# Altium schematic sheet PowerSupply.SchDoc
size Letter; SheetNumber: 3; SheetTotal: 5
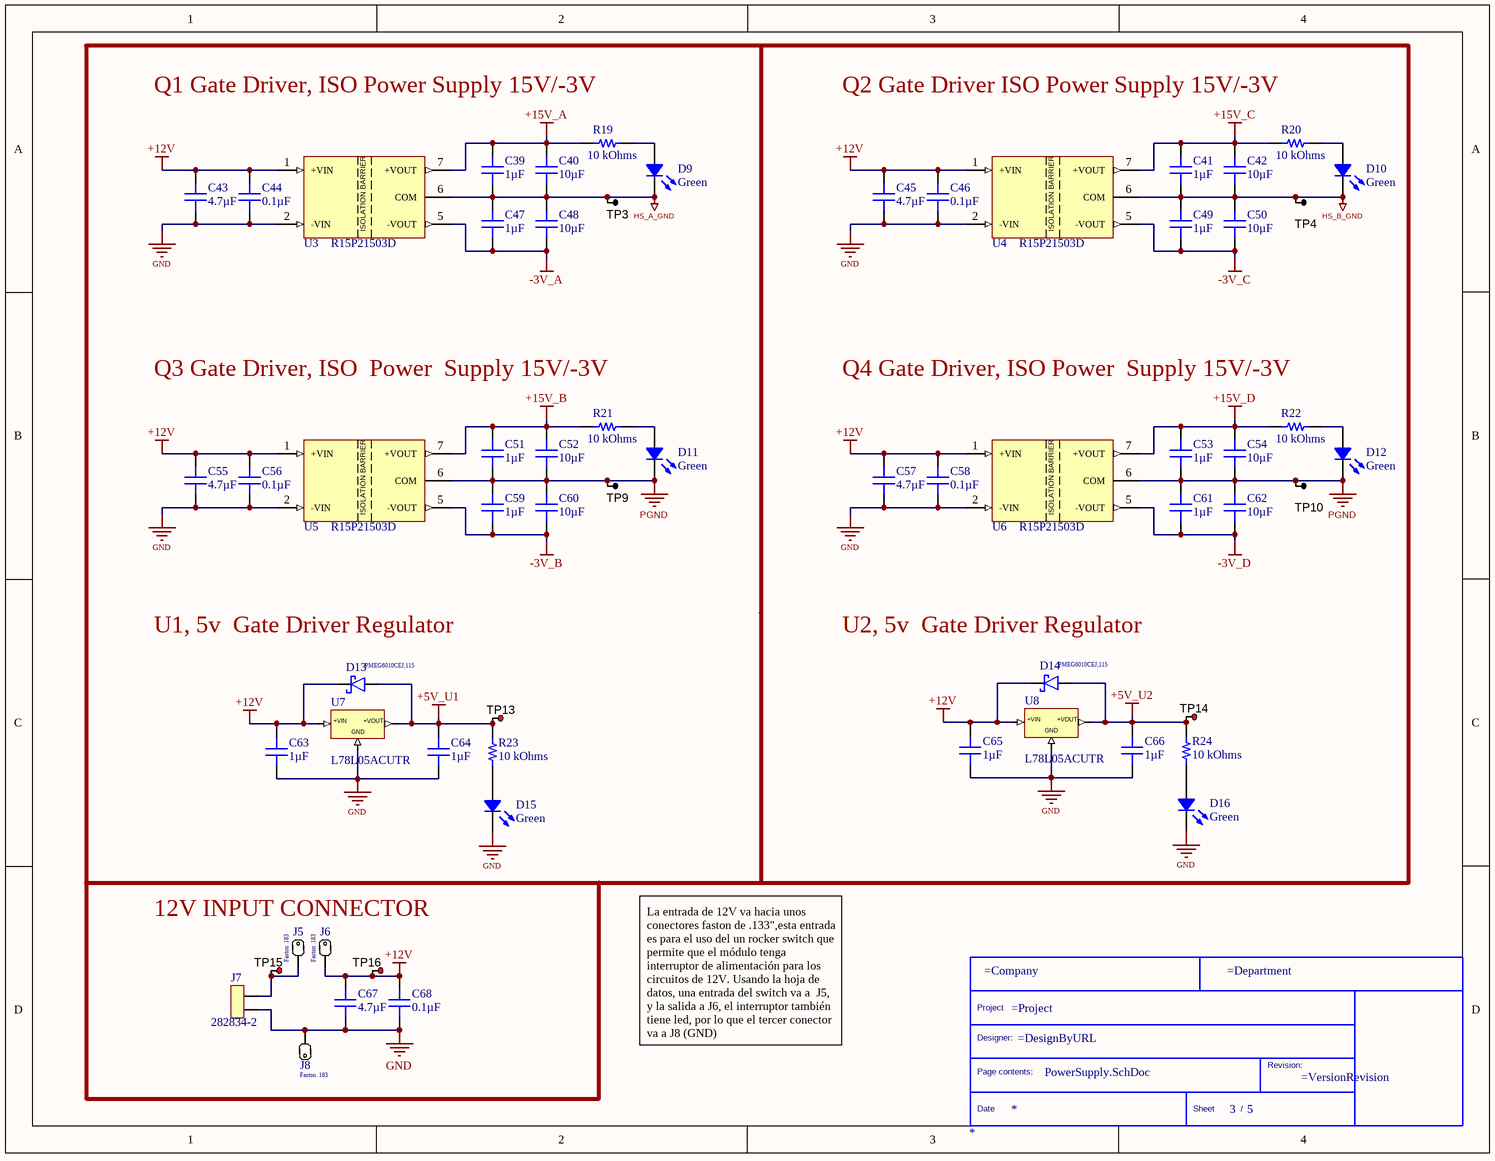
[diagram p0: PowerSupply.SchDoc]

## Parts
*  TittleBlock  (value not drawn)  (graphical)
C39  1µF  [CAP 0603_1608]
C40  10µF  [CAP 1206_3216 - 1.8MM]
C41  1µF  [CAP 0603_1608]
C42  10µF  [CAP 1206_3216 - 1.8MM]
C43  4.7µF  [CAP 1206_3216 - 1.8MM]
C44  0.1µF  [CAP 0603_1608]
C45  4.7µF  [CAP 1206_3216 - 1.8MM]
C46  0.1µF  [CAP 0603_1608]
C47  1µF  [CAP 0603_1608]
C48  10µF  [CAP 1206_3216 - 1.8MM]
C49  1µF  [CAP 0603_1608]
C50  10µF  [CAP 1206_3216 - 1.8MM]
C51  1µF  [CAP 0603_1608]
C52  10µF  [CAP 1206_3216 - 1.8MM]
C53  1µF  [CAP 0603_1608]
C54  10µF  [CAP 1206_3216 - 1.8MM]
C55  4.7µF  [CAP 1206_3216 - 1.8MM]
C56  0.1µF  [CAP 0603_1608]
C57  4.7µF  [CAP 1206_3216 - 1.8MM]
C58  0.1µF  [CAP 0603_1608]
C59  1µF  [CAP 0603_1608]
C60  10µF  [CAP 1206_3216 - 1.8MM]
C61  1µF  [CAP 0603_1608]
C62  10µF  [CAP 1206_3216 - 1.8MM]
C63  1µF  [CAP 0603_1608]
C64  1µF  [CAP 0603_1608]
C65  1µF  [CAP 0603_1608]
C66  1µF  [CAP 0603_1608]
C67  4.7µF  [CAP 1206_3216 - 1.8MM]
C68  0.1µF  [CAP 0603_1608]
D9  Green  [LED 0603_1608 GREEN]
D10  Green  [LED 0603_1608 GREEN]
D11  Green  [LED 0603_1608 GREEN]
D12  Green  [LED 0603_1608 GREEN]
D13  PMEG6010CEJ,115  [SOD-323F]
D14  PMEG6010CEJ,115  [SOD-323F]
D15  Green  [LED 0603_1608 GREEN]
D16  Green  [LED 0603_1608 GREEN]
J5  Faston .183  [TE_1217133-1]
J6  Faston .183  [TE_1217133-1]
J7  282834-2  [TE 282834-2]
J8  Faston .183  [TE_1217133-1]
R19  10 kOhms  [RES 0603_1608]
R20  10 kOhms  [RES 0603_1608]
R21  10 kOhms  [RES 0603_1608]
R22  10 kOhms  [RES 0603_1608]
R23  10 kOhms  [RES 0603_1608]
R24  10 kOhms  [RES 0603_1608]
TP3  5011  [Keystone5011]  (value not drawn)
TP4  5011  [Keystone5011]  (value not drawn)
TP9  5011  [Keystone5011]  (value not drawn)
TP10  5011  [Keystone5011]  (value not drawn)
TP13  5010  [Keystone5010]  (value not drawn)
TP14  5010  [Keystone5010]  (value not drawn)
TP15  5010  [Keystone5010]  (value not drawn)
TP16  5010  [Keystone5010]  (value not drawn)
U3  R15P21503D  [CONV_R15P21503D]
U4  R15P21503D  [CONV_R15P21503D]
U5  R15P21503D  [CONV_R15P21503D]
U6  R15P21503D  [CONV_R15P21503D]
U7  L78L05ACUTR  [VREG_L78L12ABUTR]
U8  L78L05ACUTR  [VREG_L78L12ABUTR]

## Nets
+5V_U1: C64.2 D13.2 R23.1 TP13.1 U7.1(OUT)
+5V_U2: C66.2 D14.2 R24.1 TP14.1 U8.1(OUT)
+12V: C43.2 C44.2 C45.2 C46.2 C55.2 C56.2 C57.2 C58.2 C63.2 C65.2 C67.2 C68.2 D13.1 D14.1 J6.1(P1) TP16.1 U3.1(+VIN) U4.1(+VIN) U5.1(+VIN) U6.1(+VIN) U7.3(IN) U8.3(IN)
+15V_A: C39.2 C40.2 R19.1 U3.7(+VOUT)
+15V_B: C51.2 C52.2 R21.1 U5.7(+VOUT)
+15V_C: C41.2 C42.2 R20.1 U4.7(+VOUT)
+15V_D: C53.2 C54.2 R22.1 U6.7(+VOUT)
-3V_A: C47.1 C48.1 U3.5(-VOUT)
-3V_B: C59.1 C60.1 U5.5(-VOUT)
-3V_C: C49.1 C50.1 U4.5(-VOUT)
-3V_D: C61.1 C62.1 U6.5(-VOUT)
GND: C43.1 C44.1 C45.1 C46.1 C55.1 C56.1 C57.1 C58.1 C63.1 C64.1 C65.1 C66.1 C67.1 C68.1 D15.2 D16.2 J7.2 J8.1(P1) U3.2(-VIN) U4.2(-VIN) U5.2(-VIN) U6.2(-VIN) U7.2(GND) U8.2(GND)
HS_A_GND: C39.1 C40.1 C47.2 C48.2 D9.2 TP3.1 U3.6(COM)
HS_B_GND: C41.1 C42.1 C49.2 C50.2 D10.2 TP4.1 U4.6(COM)
PGND: C51.1 C52.1 C53.1 C54.1 C59.2 C60.2 C61.2 C62.2 D11.2 D12.2 TP9.1 TP10.1 U5.6(COM) U6.6(COM)
NetD9_1: D9.1 R19.2
NetD10_1: D10.1 R20.2
NetD11_1: D11.1 R21.2
NetD12_1: D12.1 R22.2
NetD15_1: D15.1 R23.2
NetD16_1: D16.1 R24.2
NetJ5_1: J5.1(P1) J7.1 TP15.1

## Notes on the sheet
- Q1 Gate Driver, ISO Power Supply 15V/-3V
- Q2 Gate Driver ISO Power Supply 15V/-3V
- Q3 Gate Driver, ISO  Power  Supply 15V/-3V
- Q4 Gate Driver, ISO Power  Supply 15V/-3V
- (near D13) U1, 5v  Gate Driver Regulator
- (near D14) U2, 5v  Gate Driver Regulator
- 12V INPUT CONNECTOR
- La entrada de 12V va hacia unos conectores faston de .133",esta entrada es para el uso del un rocker switch que permite que el módulo tenga interruptor de alimentación para los circuitos de 12V. Usando la hoja de datos, una entrada del switch va a  J5, y la salida a J6, el interruptor también tiene led, por lo que el tercer conector  va a J8 (GND)
  .
- (in symbol L78L05ACUTR) +VIN; +VOUT
- (in symbol R15P21503D) ISOLATION BARRIER
- (in symbol TittleBlock) Project; Designer:; Page contents:; Revision:; Date; Sheet; /

## Library data of the parts
* = TittleBlock: Standard Title block
C39 C41 C47 C49 C51 C53 C59 C61 = UMK107AB7105KA-T: CAP CER 1UF 50V X7R 0603; Manufacturer: Taiyo Yuden; Tolerance: ±10%; Part Number: UMK107AB7105KA-T; Value: 1µF; Applications: General Purpose; Capacitance: 1µF; ComponentLink1Description: Datasheet; ComponentLink1URL: https://www.yuden.co.jp/productdata/catalog/mlcc01_e.pdf; ComponentLink2Description: DigiKey Link; ComponentLink2URL: http://digikey.com/product-detail/en/taiyo-yuden/UMK107AB7105KA-T/587-3247-1-ND/3660107; Device Package: 0603 (1608 Metric); LastUpdated: 2/9/2020 01:03:17; Lifecycle Status: Active; Minimum Order: 1; Mounting Type: Surface Mount, MLCC; Operating Temperature: -55°C ~ 125°C; Package / Case: 0603 (1608 Metric); Packaging: TapeAndReel; PartId: 12796; Part Status: Active; Price: 0.05; Series: M; Size / Dimension: 0.063" L x 0.031" W (1.60mm x 0.80mm); Supplier 1: DigiKey; Supplier Part Number 1: 587-3247-1-ND; Temperature Coefficient: X7R; Thickness (Max): 0.037" (0.95mm); Voltage - Rated: 50V
C40 C42 C48 C50 C52 C54 C60 C62 = TMK316AB7106KL-T: CAP CER 10UF 25V X7R 1206; Manufacturer: Taiyo Yuden; Tolerance: ±10%; Part Number: TMK316AB7106KL-T; Value: 10µF; Applications: General Purpose; Capacitance: 10µF; ComponentLink1Description: Datasheet; ComponentLink1URL: https://www.yuden.co.jp/productdata/catalog/mlcc01_e.pdf; ComponentLink2Description: DigiKey Link; ComponentLink2URL: http://digikey.com/product-detail/en/taiyo-yuden/TMK316AB7106KL-T/587-3486-1-ND/4157519; Device Package: 1206 (3216 Metric); LastUpdated: 2/9/2020 01:05:40; Lifecycle Status: Active; Minimum Order: 1; Mounting Type: Surface Mount, MLCC; Operating Temperature: -55°C ~ 125°C; Package / Case: 1206 (3216 Metric); Packaging: TapeAndReel; PartId: 20052; Part Status: Active; Price: 0.08; Series: M; Size / Dimension: 0.126" L x 0.063" W (3.20mm x 1.60mm); Supplier 1: DigiKey; Supplier Part Number 1: 587-3486-1-ND; Temperature Coefficient: X7R; Thickness (Max): 0.071" (1.80mm); Voltage - Rated: 25V
C43 C45 C55 C57 C67 = UMK316AB7475KL-T: CAP CER 4.7UF 50V X7R 1206; Manufacturer: Taiyo Yuden; Tolerance: ±10%; Part Number: UMK316AB7475KL-T; Value: 4.7µF; Applications: General Purpose; Capacitance: 4.7µF; ComponentLink1Description: Datasheet; ComponentLink1URL: https://www.yuden.co.jp/productdata/catalog/mlcc01_e.pdf; ComponentLink2Description: DigiKey Link; ComponentLink2URL: http://digikey.com/product-detail/en/taiyo-yuden/UMK316AB7475KL-T/587-2994-1-ND/2714187; Device Package: 1206 (3216 Metric); LastUpdated: 2/9/2020 01:05:40; Lifecycle Status: Active; Minimum Order: 1; Mounting Type: Surface Mount, MLCC; Operating Temperature: -55°C ~ 125°C; Package / Case: 1206 (3216 Metric); Packaging: TapeAndReel; PartId: 20094; Part Status: Active; Price: 0.08; Series: M; Size / Dimension: 0.126" L x 0.063" W (3.20mm x 1.60mm); Supplier 1: DigiKey; Supplier Part Number 1: 587-2994-1-ND; Temperature Coefficient: X7R; Thickness (Max): 0.071" (1.80mm); Voltage - Rated: 50V
C44 C46 C56 C58 C68 = C0603C104M5RACTU: CAP CER 0.1UF 50V X7R 0603; Manufacturer: KEMET; Tolerance: ±20%; Part Number: C0603C104M5RACTU; Value: 0.1µF; Applications: Bypass, Decoupling; Capacitance: 0.1µF; ComponentLink1Description: Datasheet; ComponentLink1URL: https://api.kemet.com/component-edge/download/datasheet/C0603C104M5RACTU.pdf; ComponentLink2Description: DigiKey Link; ComponentLink2URL: http://digikey.com/product-detail/en/kemet/C0603C104M5RACTU/399-7845-1-ND/3471568; Device Package: 0603 (1608 Metric); LastUpdated: 2/9/2020 01:03:01; Lifecycle Status: Active; Minimum Order: 1; Mounting Type: Surface Mount, MLCC; Operating Temperature: -55°C ~ 125°C; Package / Case: 0603 (1608 Metric); Packaging: TapeAndReel; PartId: 17854; Part Status: Active; Price: 0.01; Series: SMD Comm X7R; Size / Dimension: 0.063" L x 0.031" W (1.60mm x 0.80mm); Supplier 1: DigiKey; Supplier Part Number 1: 399-7845-1-ND; Temperature Coefficient: X7R; Thickness (Max): 0.034" (0.87mm); Voltage - Rated: 50V
C63 C65 = TMK107B7105KA-T: CAP CER 1UF 25V X7R 0603; Manufacturer: Taiyo Yuden; Tolerance: ±10%; Part Number: TMK107B7105KA-T; Value: 1µF; Applications: General Purpose; Capacitance: 1µF; ComponentLink1Description: Datasheet; ComponentLink1URL: https://www.yuden.co.jp/productdata/catalog/mlcc01_e.pdf; ComponentLink2Description: DigiKey Link; ComponentLink2URL: http://digikey.com/product-detail/en/taiyo-yuden/TMK107B7105KA-T/587-2984-1-ND/2714177; Device Package: 0603 (1608 Metric); LastUpdated: 2/9/2020 01:03:30; Lifecycle Status: Active; Minimum Order: 1; Mounting Type: Surface Mount, MLCC; Operating Temperature: -55°C ~ 125°C; Package / Case: 0603 (1608 Metric); Packaging: TapeAndReel; PartId: 5586; Part Status: Active; Price: 0.01; Series: M; Size / Dimension: 0.063" L x 0.031" W (1.60mm x 0.80mm); Supplier 1: DigiKey; Supplier Part Number 1: 587-2984-1-ND; Temperature Coefficient: X7R; Thickness (Max): 0.035" (0.90mm); Voltage - Rated: 25V
C64 C66 = CC0603KRX7R7BB105: CAP CER 1UF 16V X7R 0603; Manufacturer: Yageo; Tolerance: ±10%; Part Number: CC0603KRX7R7BB105; Value: 1µF; Applications: General Purpose; Capacitance: 1µF; ComponentLink1Description: Datasheet; ComponentLink1URL: https://www.yageo.com/upload/media/product/productsearch/datasheet/mlcc/UPY-GPHC_X7R_6.3V-to-50V_18.pdf; ComponentLink2Description: DigiKey Link; ComponentLink2URL: http://digikey.com/product-detail/en/yageo/CC0603KRX7R7BB105/311-1446-1-ND/2833752; Device Package: 0603 (1608 Metric); LastUpdated: 2/9/2020 01:03:31; Lifecycle Status: Active; Minimum Order: 1; Mounting Type: Surface Mount, MLCC; Operating Temperature: -55°C ~ 125°C; Package / Case: 0603 (1608 Metric); Packaging: TapeAndReel; PartId: 5233; Part Status: Active; Price: 0.01; Series: CC; Size / Dimension: 0.063" L x 0.031" W (1.60mm x 0.80mm); Supplier 1: DigiKey; Supplier Part Number 1: 311-1446-1-ND; Temperature Coefficient: X7R; Thickness (Max): 0.035" (0.90mm); Voltage - Rated: 16V
D9-D12 D15 D16 = 150060GS75000: LED GREEN CLEAR 0603 SMD; Manufacturer: Würth Elektronik; Configuration: Standard; Current - Test: 20mA; Lens Color: Colorless; Lens Size: 1.10mm x 0.70mm; Lens Style: Rectangle with Flat Top; Millicandela Rating: 430mcd; Viewing Angle: 140°; Voltage - Forward (Vf) (Typ): 3.2V; Wavelength - Dominant: 520nm; Wavelength - Peak: 515nm; Part Number: 150060GS75000; Color: Green; ComponentLink1Description: Datasheet; ComponentLink1URL: https://katalog.we-online.de/led/datasheet/150060GS75000.pdf; ComponentLink2Description: DigiKey Link; ComponentLink2URL: http://digikey.com/product-detail/en/w-rth-elektronik/150060GS75000/732-4971-1-ND/4489896; Device Package: 0603 (1608 Metric); Height (Max): 0.80mm; LastUpdated: 2/9/2020 01:20:41; Lens Transparency: Clear; Lifecycle Status: Active; Minimum Order: 1; Mounting Type: Surface Mount; Package / Case: 0603 (1608 Metric); Packaging: TapeAndReel; PartId: 686; Part Status: Active; Price: 0.10; Series: WL-SMCW; Size / Dimension: 1.60mm L x 0.80mm W; Supplier 1: DigiKey; Supplier Part Number 1: 732-4971-1-ND; Supplier Device Package: 0603; Value: Green
D13 D14 = PMEG6010CEJ,115: PMEG6010CEH; PMEG6010CEJ - 1 A very low VF MEGA Schottky barrier rectifiers; Manufacturer: Nexperia; Supplier 1: Digi-Key; Supplier Part Number 1: 1727-3882-1-ND; Manufacturer Part Number: PMEG6010CEJ,115; RoHS: Yes; Category: Rectifier Diodes; Stock 1: 105369; Pricing 1: 1=0,35000, 10=0,27200, 100=0,16340, 500=0,15128, 1000=0,10288 (USD); ComponentLink1URL: https://www.mouser.com/ds/2/302/PMEG6010CEH_PMEG6010CEJ-102368.pdf?src-supplier=Mouser; ComponentLink1Description: https://www.mouser.com/ds/2/302/PMEG6010CEH_PMEG6010CEJ-102368.pdf?src-supplier=Mouser; ComponentLink2URL: http://www.farnell.com/datasheets/109684.pdf?src-supplier=Farnell; ComponentLink2Description: http://www.farnell.com/datasheets/109684.pdf?src-supplier=Farnell; ComponentLink3URL: http://www.farnell.com/datasheets/109684.pdf?src-supplier=Newark; ComponentLink3Description: http://www.farnell.com/datasheets/109684.pdf?src-supplier=Newark; ComponentLink4URL: https://assets.nexperia.com/documents/data-sheet/PMEG6010CEH_PMEG6010CEJ.pdf?src-supplier=Digi-Key; ComponentLink4Description: https://assets.nexperia.com/documents/data-sheet/PMEG6010CEH_PMEG6010CEJ.pdf?src-supplier=Digi-Key
J5 J6 J8 = 1217133-1: FASTON 187 PCB TAB TPBR; MF: TE Connectivity; SnapEDA_Link: https://www.snapeda.com/parts/1217133-1/TE%20Connectivity%20AMP%20Connectors/view-part/660570/?ref=snap; MP: 1217133-1; EU_RoHS_Compliance: Compliant; Availability: Good; Price: None; Value: *; Check_prices: https://www.snapeda.com/parts/1217133-1/TE%20Connectivity%20AMP%20Connectors/view-part/660570/?ref=eda; Package: None; Purchase-URL: https://pricing.snapeda.com/search/part/1217133-1/?ref=eda
J7 = 282834-2: TE CONNECTIVITY / BUCHANAN - 282834-2 - TERMINAL BLOCK, WIRE TO BRD, 2POS, 16AWG; Plating: Brass,Steel; Number of Contacts: 2; Voltage Rating: 150V; Number of Levels: 1; Current: 10A; Connector Type: Receptacle; Interlock: No (Without); Screwless Terminal Block: Yes (With); Gender: Male; Pitch: 2.54mm; Wire Gauge (Max): 30AWG; Thread Size: M1.6; Tail Length: 3.4mm; Approvals: UL; Supplier 1: Digi-Key; Supplier Part Number 1: A98333-ND; Manufacturer: TE Connectivity; Manufacturer Part Number: 282834-2; RoHS: Yes; Category: Terminal Blocks; Stock 1: 21575; Pricing 1: 1=1,27000, 10=0,89500, 25=0,83440, 50=0,75740, 100=0,75410, 250=0,63676, 500=0,60324, 1000=0,53622, 5000=0,50270 (USD); Mount: Through Hole; Housing Color: Green; Contact Plating: Tin; Contact Material: Brass; Color: Green; Housing Material: Polyamide; Material: Nylon; Min Operating Temperature: -40°C; Max Operating Temperature: 105°C; Number of Rows: 1; Termination: Solder; Orientation: Straight; Package Quantity: 300; Packaging: Bulk; Number of Positions: 2; Number of Positions Per Level: 2; Voltage: 150V; Max Supply Voltage (AC): 150V; Number of Circuits: 2; Screw Flange: No (Without); Side Stackable: Yes (With); Series: Buchanan; Max Voltage Rating (AC): 150V; Current Rating: 10A; Closed End: No (Without); Max Current Rating: 10A; Number of Poles: 2; Length: 5.54mm; Width: 6.5mm; Wire Gauge (Min): 30AWG; Depth: 6.5mm; Wire/Cable Gauge: 30AWG; Radiation Hardening: No; ELV: Compliant; Flammability Rating: UL94 V-0; RoHS Compliant: Yes; Lead Free: Lead Free; REACH SVHC: Unknown; ComponentLink1URL: https://datasheet.ciiva.com/11758/0900766b80e7dc96-11758675.pdf?src-supplier=RSComponents; ComponentLink1Description: https://datasheet.ciiva.com/11758/0900766b80e7dc96-11758675.pdf?src-supplier=RSComponents; ComponentLink2URL: https://datasheet.ciiva.com/16386/282834-2-16386363.pdf?src-supplier=Future+Electronics; ComponentLink2Description: https://datasheet.ciiva.com/16386/282834-2-16386363.pdf?src-supplier=Future+Electronics; ComponentLink3URL: https://datasheet.ciiva.com/14609/70086732-14609670.pdf?src-supplier=Allied+Electronics; ComponentLink3Description: https://datasheet.ciiva.com/14609/70086732-14609670.pdf?src-supplier=Allied+Electronics; ComponentLink4URL: https://datasheet.ciiva.com/15169/getdatasheetpartid-155864-15169558.pdf?src-supplier=Verical; ComponentLink4Description: https://datasheet.ciiva.com/15169/getdatasheetpartid-155864-15169558.pdf?src-supplier=Verical; ComponentLink5URL: https://datasheet.ciiva.com/16676/eng-cs-1308389-eurostyle-terminal-blocks-0607-16676126.pdf?src-supplier=Avnet+Europe; ComponentLink5Description: https://datasheet.ciiva.com/16676/eng-cs-1308389-eurostyle-terminal-blocks-0607-16676126.pdf?src-supplier=Avnet+Europe; ComponentLink6URL: https://datasheet.ciiva.com/30166/eng-cs-1308389-eurostyle-terminal-blocks-0607-30166974.pdf?src-supplier=Onlinecomponents.com; ComponentLink6Description: https://datasheet.ciiva.com/30166/eng-cs-1308389-eurostyle-terminal-blocks-0607-30166974.pdf?src-supplier=Onlinecomponents.com; ComponentLink7URL: https://datasheet.ciiva.com/3141/eng-cs-1308389-eurostyle-terminal-blocks-0607-3141115.pdf?src-supplier=Avnet; ComponentLink7Description: https://datasheet.ciiva.com/3141/eng-cs-1308389-eurostyle-terminal-blocks-0607-3141115.pdf?src-supplier=Avnet; ComponentLink8URL: https://datasheet.ciiva.com/823/eng-cd-282834-c1-823453.pdf?src-supplier=Digi-Key; ComponentLink8Description: https://datasheet.ciiva.com/823/eng-cd-282834-c1-823453.pdf?src-supplier=Digi-Key
R19-R24 = RC0603FR-0710KL: RES SMD 10K OHM 1% 1/10W 0603; Manufacturer: Yageo; Power (Watts): 0.1W, 1/10W; Temperature Coefficient: ±100ppm/°C; Part Number: RC0603FR-0710KL; Value: 10 kOhms; ComponentLink1Description: Datasheet; ComponentLink1URL: https://www.yageo.com/upload/media/product/productsearch/datasheet/rchip/PYu-RC_Group_51_RoHS_L_10.pdf; ComponentLink2Description: DigiKey Link; ComponentLink2URL: http://digikey.com/product-detail/en/yageo/RC0603FR-0710KL/311-10.0KHRCT-ND/729827; Composition: Thick Film; Device Package: 0603 (1608 Metric); Features: Moisture Resistant; Height - Seated (Max): 0.022" (0.55mm); LastUpdated: 2/9/2020 01:09:45; Lifecycle Status: Active; Minimum Order: 1; Number of Terminations: 2; Operating Temperature: -55°C ~ 155°C; Package / Case: 0603 (1608 Metric); Packaging: CutTape; PartId: 22599; Part Status: Active; Price: 0.10; Resistance: 10 kOhms; Series: RC; Size / Dimension: 0.063" L x 0.031" W (1.60mm x 0.80mm); Supplier 1: DigiKey; Supplier Part Number 1: 311-10.0KHRCT-ND; Supplier Device Package: 0603; Tolerance: ±1%
TP3 TP4 TP9 TP10 = 5011: Test Point, Multipurpose, Black, TH; Manufacturer: Keystone; CompType: Test Point Loop; ContactFinish: Silver; SymbolVersion: 2008-04-04; PartNumber: 5011; PackageReference: Black Multipurpose Testpoint; RoHS: Y; MountType: TH; ComponentLink1Description: Datasheet URL; ComponentLink1URL: http://www.keyelco.com/userAssets/file/M60-2p60.pdf; Color: Black; Publisher: Texas Instruments; LatestRevisionDate: 2016-02-11; Supplier 1: Digi-Key; Supplier Part Number 1: 36-5011-ND; Supplier 2: Mouser; Supplier Part Number 2: 534-5011
TP13-TP16 = 5010: Test Point, Multipurpose, Red, TH; Manufacturer: Keystone; CompType: Test Point Loop; ContactFinish: Silver; SymbolVersion: 2008-04-04; PartNumber: 5010; PackageReference: Red Multipurpose Testpoint; RoHS: Y; MountType: TH; ComponentLink1Description: Datasheet URL; ComponentLink1URL: http://www.keyelco.com/userAssets/file/M60-2p60.pdf; Color: Red; Publisher: Texas Instruments; LatestRevisionDate: 2016-02-11; Supplier 1: Digi-Key; Supplier Part Number 1: 36-5010-ND; Supplier 2: Mouser; Supplier Part Number 2: 534-5010
U3-U6 = R15P21503D: 2W DC/DC-Converter 'ECONOLINE' SIP7 6.4kV unreg; V. In: 15; V. Out: +15/-03; mA. Out: +93/-185; Manufacturer: Recom; Max Output Voltage: 15V; Supplier 1: Digi-Key; Supplier Part Number 1: 945-3070-5-ND; Manufacturer Part Number: R15P21503D; RoHS: Yes; Category: Voltage Regulators - Switching; Stock 1: 1614; Pricing 1: 1=8,47000, 5=8,31800, 10=8,25500, 25=8,12800, 50=7,87400, 100=7,26000, 250=6,98500, 500=6,85800 (USD); Weight: 4.3g; Length: 19.5mm; Width: 9.8mm; Height: 12.5mm; RoHS Compliant: Yes; ComponentLink1URL: https://www.recom-power.com/pdf/Econoline/RxxP2xxyy.pdf?src-supplier=Digi-Key; ComponentLink1Description: https://www.recom-power.com/pdf/Econoline/RxxP2xxyy.pdf?src-supplier=Digi-Key
U7 U8 = L78L05ACUTR: Voltage regulator; linear, fixed; 5V; 0.1A; SOT89; SMD; 0÷125°C; Manufacturer: STMicroelectronics; Number of Outputs: 1; Max Input Voltage: 30V; Max Output Current: 100mA; Polarity: Positive; Quiescent Current: 6mA; Accuracy: 4%; Dropout Voltage: 1.7V; Min Input Voltage: 7V; Power Supply Rejection Ratio (PSRR): 49dB; Supplier 1: Digi-Key; Supplier Part Number 1: 497-1183-1-ND; Manufacturer Part Number: L78L05ACUTR; RoHS: Yes; Category: Voltage Regulators - Linear; Stock 1: 40018; Pricing 1: 1=0,53000, 10=0,43300, 25=0,39600, 100=0,26710, 250=0,22108, 500=0,20266, 1000=0,17380 (USD); Mount: Surface Mount; Case/Package: SOT-89; Number of Pins: 3; Weight: 0.004603oz; Contact Plating: Tin,Matte; Min Operating Temperature: 0°C; Max Operating Temperature: 125°C; Output Voltage: 5V; Output Type: Fixed; Package Quantity: 1; Packaging: Tape and Reel; Output Current: 100mA; Nominal Output Voltage: 5V; Number of Regulators: 1; Min Output Voltage: 5V; Output Voltage Accuracy: 4%; Series: -; Length: 4.6mm; Width: 2.6mm; Height: 1.6mm; Radiation Hardening: No; REACH SVHC: No SVHC; Lead Free: Lead Free; RoHS Compliant: Yes; ComponentLink1URL: https://datasheet.ciiva.com/2041/cd00000446-2041792.pdf?src-supplier=Digi-Key; ComponentLink1Description: https://datasheet.ciiva.com/2041/cd00000446-2041792.pdf?src-supplier=Digi-Key; ComponentLink2URL: https://datasheet.ciiva.com/1511/1868798-1511940.pdf?src-supplier=Element14; ComponentLink2Description: https://datasheet.ciiva.com/1511/1868798-1511940.pdf?src-supplier=Element14; ComponentLink3URL: https://datasheet.ciiva.com/7992/1868798-7992600.pdf?src-supplier=Element14; ComponentLink3Description: https://datasheet.ciiva.com/7992/1868798-7992600.pdf?src-supplier=Element14; ComponentLink4URL: https://datasheet.ciiva.com/16393/cd00000446-16393708.pdf?src-supplier=Future+Electronics; ComponentLink4Description: https://datasheet.ciiva.com/16393/cd00000446-16393708.pdf?src-supplier=Future+Electronics; ComponentLink5URL: https://datasheet.ciiva.com/22710/1868798-22710940.pdf?src-supplier=Element14; ComponentLink5Description: https://datasheet.ciiva.com/22710/1868798-22710940.pdf?src-supplier=Element14; ComponentLink6URL: https://datasheet.ciiva.com/4882/cd00000446-355303-4882429.pdf?src-supplier=Mouser; ComponentLink6Description: https://datasheet.ciiva.com/4882/cd00000446-355303-4882429.pdf?src-supplier=Mouser; ComponentLink7URL: https://datasheet.ciiva.com/2041/cd00000446-2041790.pdf?src-supplier=Digi-Key; ComponentLink7Description: https://datasheet.ciiva.com/2041/cd00000446-2041790.pdf?src-supplier=Digi-Key; ComponentLink8URL: https://datasheet.ciiva.com/2041/cd00000446-2041791.pdf?src-supplier=Digi-Key; ComponentLink8Description: https://datasheet.ciiva.com/2041/cd00000446-2041791.pdf?src-supplier=Digi-Key